# Altium schematic sheet BattVoltageLevelDetector.SchDoc
size A
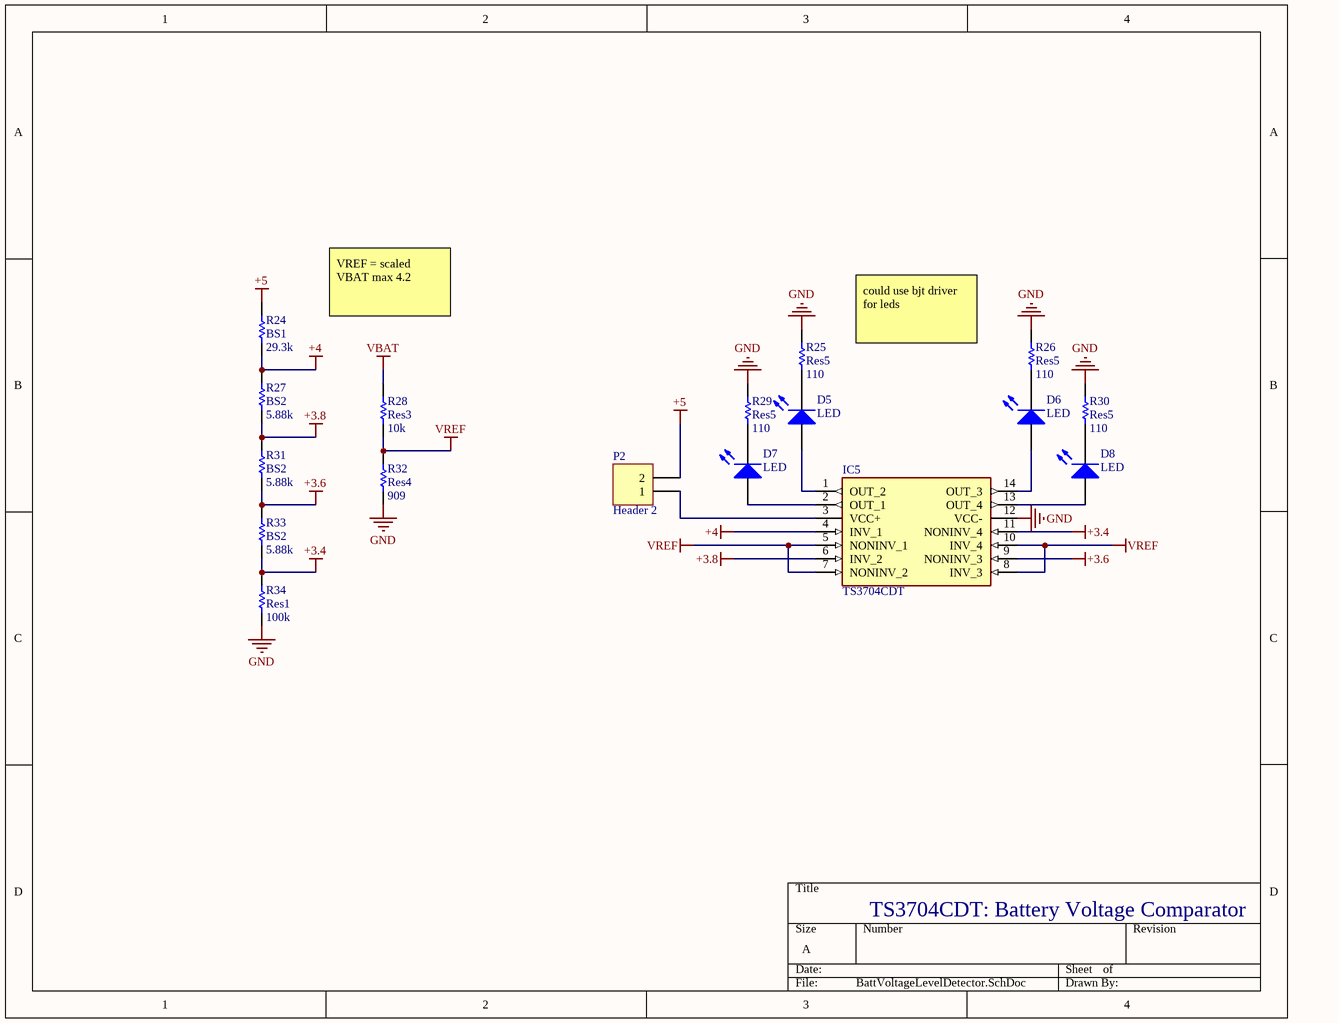
[diagram p0: BattVoltageLevelDetector.SchDoc]

## Parts
D5  LED  [0402]
D6  LED  [0402]
D7  LED  [0402]
D8  LED  [0402]
IC5  TS3704CDT  [SOIC127P600X175-14N]
P2  Header 2  [HDR1X2]
R24  BS1  value 29.3k  [0402]
R25  Res5  value 110  [0402]
R26  Res5  value 110  [0402]
R27  BS2  value 5.88k  [0402]
R28  Res3  value 10k  [0402]
R29  Res5  value 110  [0402]
R30  Res5  value 110  [0402]
R31  BS2  value 5.88k  [0402]
R32  Res4  value 909  [0402]
R33  BS2  value 5.88k  [0402]
R34  Res1  value 100k  [0402]

## Nets
+3.4: IC5.11(NONINV_4) R33.1 R34.2
+3.6: IC5.9(NONINV_3) R31.1 R33.2
+3.8: IC5.6(INV_2) R27.1 R31.2
+4: IC5.4(INV_1) R24.1 R27.2
+5: P2.2 R24.2
GND: IC5.12(VCC-) R25.2 R26.2 R29.2 R30.2 R32.1 R34.1
VBAT: R28.2
VREF: IC5.5(NONINV_1) IC5.7(NONINV_2) IC5.8(INV_3) IC5.10(INV_4) R28.1 R32.2
NetD5_1: D5.1(A) IC5.1(OUT_2)
NetD5_2: D5.2(K) R25.1
NetD6_1: D6.1(A) IC5.14(OUT_3)
NetD6_2: D6.2(K) R26.1
NetD7_1: D7.1(A) IC5.2(OUT_1)
NetD7_2: D7.2(K) R29.1
NetD8_1: D8.1(A) IC5.13(OUT_4)
NetD8_2: D8.2(K) R30.1
NetIC5_3: IC5.3(VCC+) P2.1

## Notes on the sheet
- VREF = scaled VBAT max 4.2
- could use bjt driver for leds
- TS3704CDT: Battery Voltage Comparator

## Library data of the parts
D5-D8 = LED0: Typical INFRARED GaAs LED; Published: 8-Jun-2000; LatestRevisionDate: 08-Jul-2005; LatestRevisionNote: Mech Layer 1 removed.; PackageReference: LED-0; Publisher: Altium Limited; PackageDescription: LED; 2 Leads
IC5 = TS3704CDT: Integrated Circuit; Manufacturer_Name: STMicroelectronics; Datasheet Link: http://www.st.com/content/ccc/resource/technical/document/datasheet/ff/2a/23/35/c2/34/44/f1/CD00000883.pdf/files/CD00000883.pdf/jcr:content/translations/en.CD00000883.pdf; Height: 1.75mm; Manufacturer_Part_Number: TS3704CDT; Mouser Part Number: 511-TS3704CDT; Mouser Price/Stock: https://www.mouser.com/Search/Refine.aspx?Keyword=511-TS3704CDT; RS Part Number: 8805496P; RS Price/Stock: http://uk.rs-online.com/web/p/products/8805496P
P2 = Header 2: Header, 2-Pin; LatestRevisionDate: 17-Jul-2002; LatestRevisionNote: Re-released for DXP Platform.; Publisher: Altium Limited
R24-R34 = Res1: Resistor; Published: 8-Jun-2000; LatestRevisionDate: 17-Jul-2002; LatestRevisionNote: Re-released for DXP Platform.; PackageReference: AXIAL-0.3; Publisher: Altium Limited; PackageDescription: Axial Device, Thru-Hole; 2 Leads; 0.3 in Pin Spacing